# Altium project Sam4S Basic_5 .PrjPcb
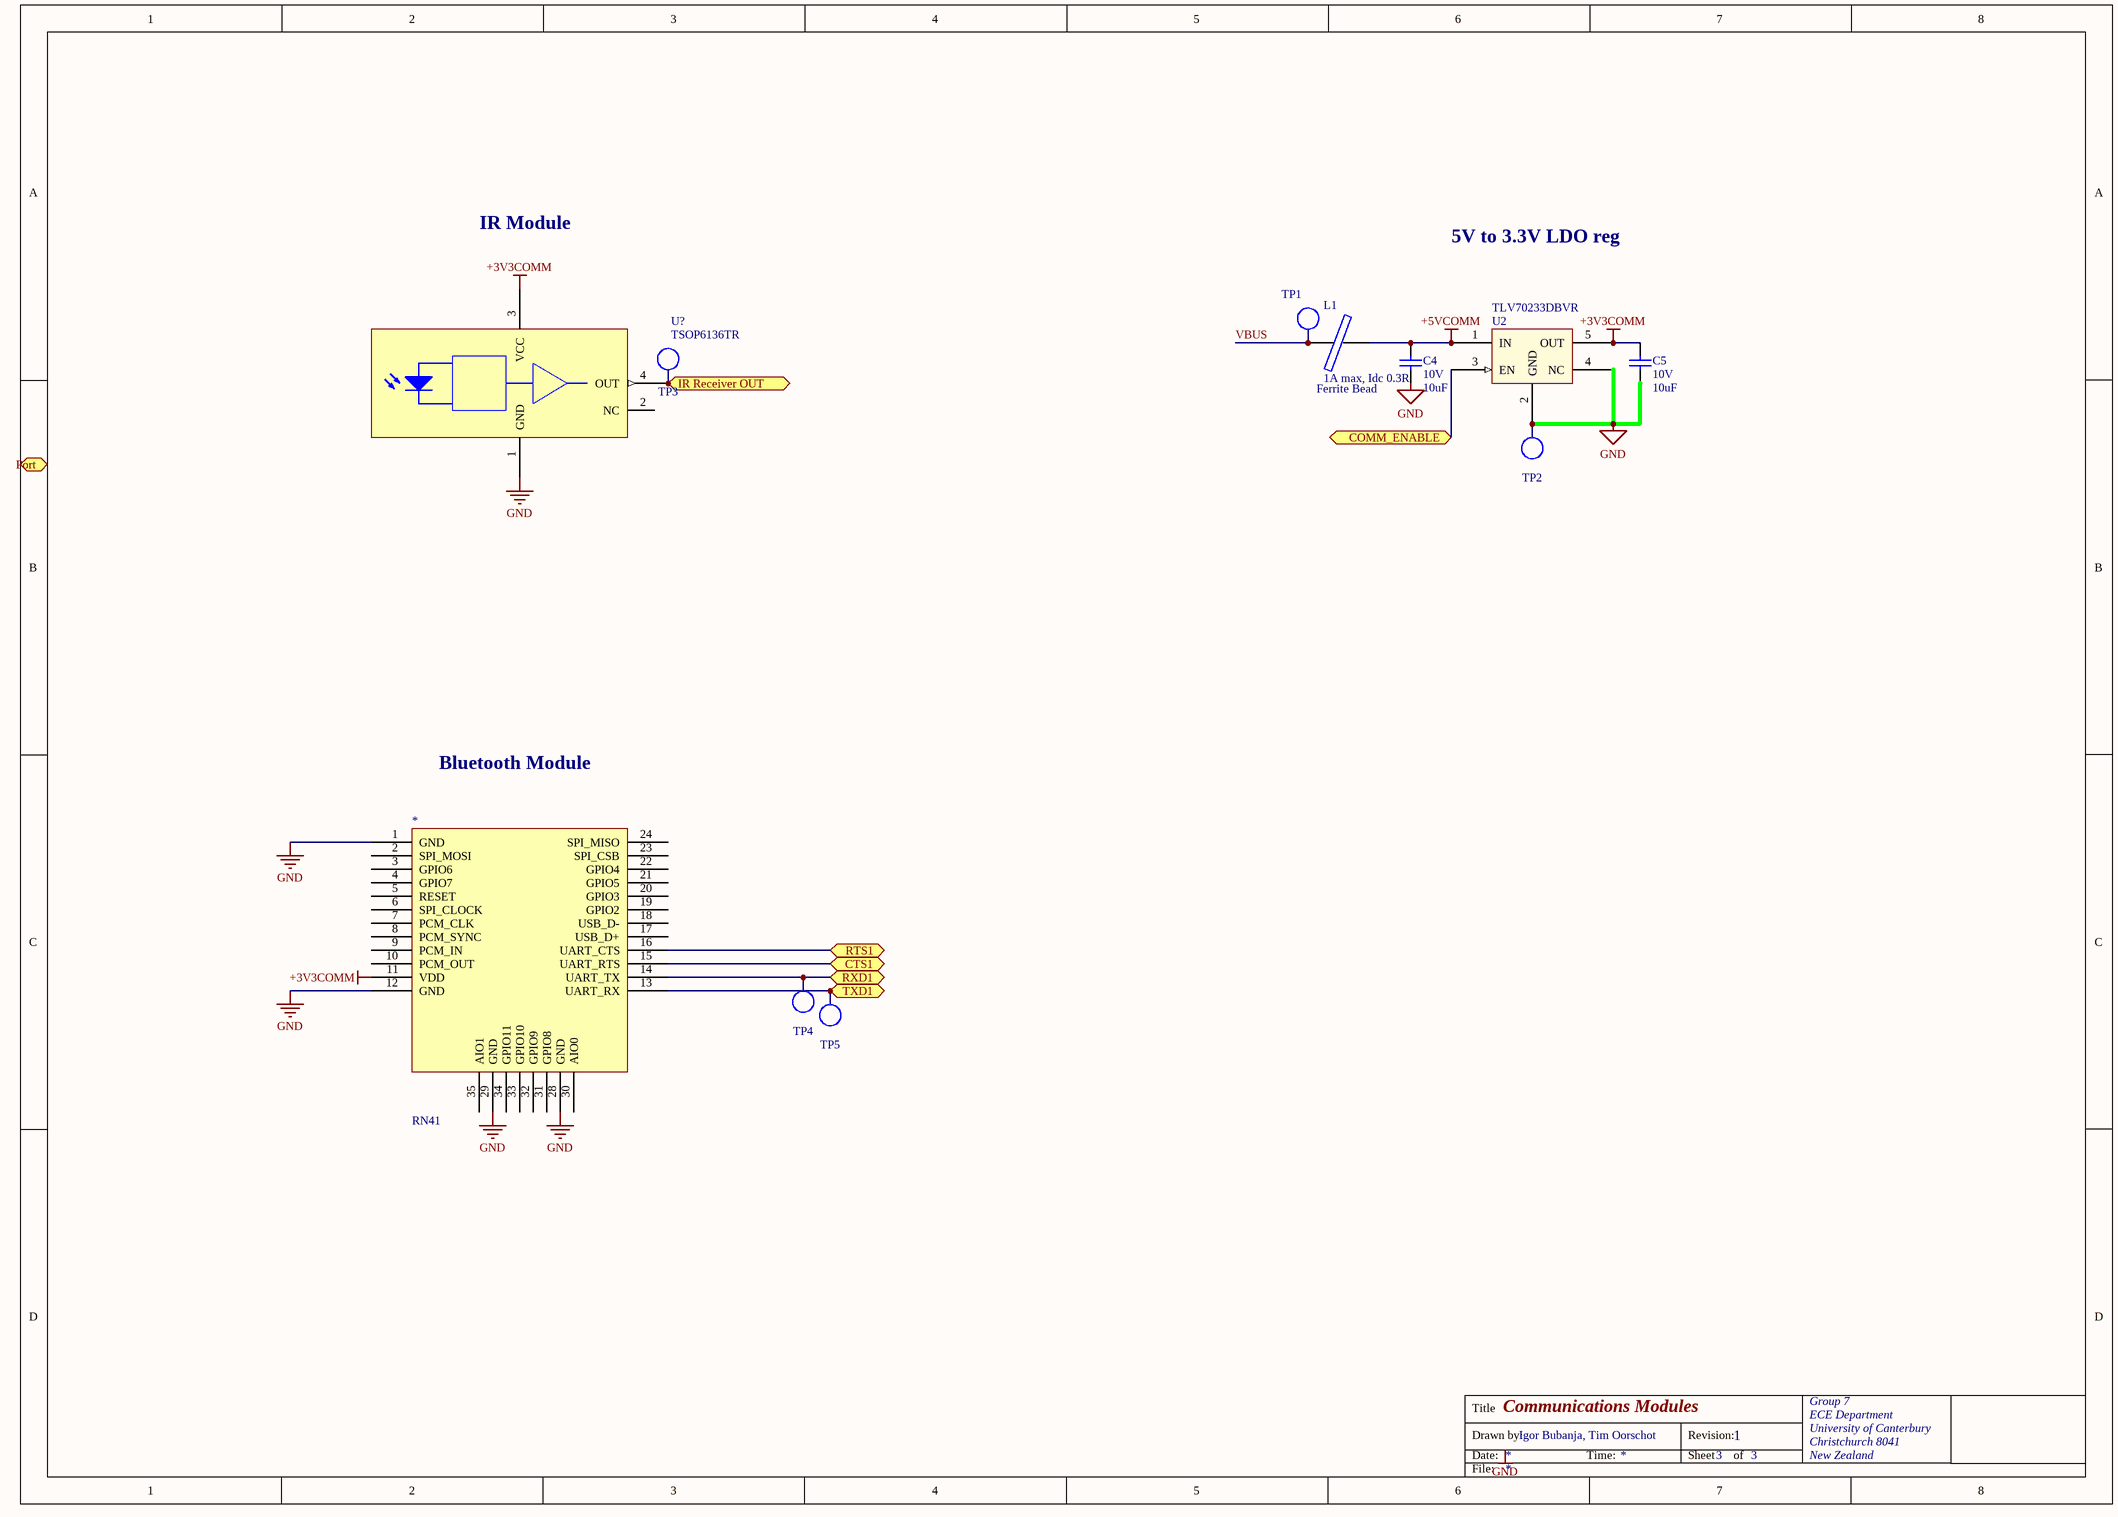
[diagram p0: Sheet1.SchDoc]
3 sheets, 79 parts. Net scope: flat (ports and power ports of the same name join across sheets).
Board file: Sam4S Basic Board 5.PcbDoc
Sheets:
  Sheet1.SchDoc
  Sam4S Basic Board 5.SchDoc
  Sam4S Power Distribution_5.SchDoc

## Sheet Sheet1.SchDoc: Communications Modules
size A3; DrawnBy: Igor Bubanja, Tim Oorschot; Organization: Group 7; Address1: ECE Department; Address2: University of Canterbury; Address3: Christchurch 8041; Address4: New Zealand; Revision: 1; SheetNumber: 3; SheetTotal: 3

### Parts
(Parts that share a designator on the sheet are numbered #1, #2 ... from top to bottom, then left to right.)
*  RN41
C4#1  Voltage - Rated: 10V  [CAPC1608L]  (hidden comment: 10uF)
C5#1  Voltage - Rated: 10V  [CAPC1608L]  (hidden comment: 10uF)
L1#1  Ferrite Bead  value 1A max, Idc 0.3R,  [INDC3216L]
TP1#1  V_Bus  [TP_0805]  (value not drawn)
TP2#1  Gnd  [TP_0805]  (value not drawn)
TP3#1  Gnd  [TP_0805]  (value not drawn)
TP4#1  Gnd  [TP_0805]  (value not drawn)
TP5#1  Gnd  [TP_0805]  (value not drawn)
U2#1  TLV70233DBVR  [SOT95P280X145-5N]
U?  TSOP6136TR  [TSOP61]

### Ports
COMM_ENABLE, CTS1, IR Receiver OUT, Port, RTS1, RXD1, TXD1

### Nets
+3V3COMM: *.11(VDD) C5#1.1 U2#1.5(OUT) U?.3(VCC)
+5VCOMM: C4#1.1 L1#1.2 U2#1.1(IN)
GND: *.1(GND) *.12(GND) *.28(GND) *.29(GND) C4#1.2 C5#1.2 TP2#1.1(TP) U2#1.2(GND) U2#1.4(NC) U?.1(GND)
VBUS: L1#1.1 TP1#1.1(TP)
Net*_13: *.13(UART_RX) TP5#1.1(TP) ; port TXD1
Net*_14: *.14(UART_TX) TP4#1.1(TP) ; port RXD1
Net*_15: *.15(UART_RTS) ; port CTS1
Net*_16: *.16(UART_CTS) ; port RTS1
NetTP3#1_1: TP3#1.1(TP) U?.4(OUT) ; port IR Receiver OUT
NetU1_38: U2#1.3(EN) ; port COMM_ENABLE

Not connected (* = marked no-connect by the designer): * 2(SPI_MOSI) 3(GPIO6) 4(GPIO7) 5(RESET) 6(SPI_CLOCK) 7(PCM_CLK) 8(PCM_SYNC) 9(PCM_IN) 10(PCM_OUT) 17(USB_D+) 18(USB_D-) 19(GPIO2) 20(GPIO3) 21(GPIO5) 22(GPIO4) 23(SPI_CSB) 24(SPI_MISO) 30(AIO0) 31(GPIO8) 32(GPIO9) 33(GPIO10) 34(GPIO11) 35(AIO1); U? 2(NC)

### Notes on the sheet
- IR Module
- 5V to 3.3V LDO reg
- Bluetooth Module
- Labels drawn without touching a wire or pin: GND
- Title
- Drawn by:
- Date:
- Time:
- Revision:
- Sheet
- of
- File:

### Library data of the parts
* = RN41: Bluetooth RN41
C4#1 C5#1 = CC_10uF_0603: CAP CER 10UF X5R +-20% 10V 0603; Supplier: ECE Dept; Storage Location: PCB Assembly WS; Value: 10uF
L1#1 = IN_Ferrite-Bead: Ferrite Bead, Rdc 0.3R, Z100MHZ 600R, Imax 1A, SMD 1206; Manufacturer: FAIR-RITE; Manufacturer PN: 2512066017Y1; DC Current Rating: 1; DC Resistance Max: 0.08; Ferrite Case Style: 1206 ^3216 Metric]; Frequency Range: 50MHz to 1; Impedance: 600; Impedance Tolerance: ± 25%; Supplier: ECE Dept; Storage Location: PCB Assembly WS; Ferrite Mounting: SMD; Supplier 1: Farnell; Supplier Part Number 1: 1612060; Manufacturer Part Number: 2512066017Y1
TP1#1 TP2#1 TP3#1 TP4#1 TP5#1 = TP_0805: Test Point 2.0X0.9X1.2mm SMD; Manufacturer: TE Connectivity AMP Connectors; Manufacturer Part Number: 1625854-2; Supplier 1: Digi-Key; Mounting Type: Surface Mount; Terminal: 0.079" x 0.049" x 0.057" (2.00mm x 1.25mm x 1.45mm); Type: PC Test Point; Supplier Part Number 1: A106144CT-ND
U2#1 = SV_TLV70233DBVR: IC REG LDO 3.3V 0.3A SOT23-5; Manufacturer: Texas Instruments; Current - Output: 300mA; Supplier 1: Digi-Key; Operating Temperature: -40°C ~ 125°C; Package / Case: SC-74A, SOT-753; Pricing: 1=0.77, 10=0.647, 25=0.5672, 100=0.4853, 250=0.421, 500=0.35658, 750=0.30789, 1000=0.2749 (NZD); Supplier Part Number 1: 296-32415-1-ND; Manufacturer Part Number: TLV70233DBVR
U? = TSOP6136TR: Infrared Receiver 36KHz; Manufacturer: Vishay Semiconductor Opto Division; Supplier 1: Farnell; Supplier Part Number 1: 1779685; Manufacturers PN: TSOP6136TR; Manufacturer Part Number: TSOP6136TR; Supplier 2: Digi-Key; Supplier Part Number: TSOP6136TR-ND; Supplier Part Number 2: TSOP6136TR-ND

## Sheet Sam4S Basic Board 5.SchDoc: Sam 4S Basic Board 5
size A4; DrawnBy: Igor Bubanja, TIm Oorschot; Address1: ECE Department; Address2: University of Canterbury; Address3: Christchurch 8041; Address4: New Zealand; Revision: 3; SheetNumber: 1; SheetTotal: 3; PageSetup: Record=PageOptions|CenterHorizontal=True|CenterVertical=True|PrintScale=0.97|XCorrection=1.00|YCorrection=1.00|PrintKind=0|BorderSize=5000000|LeftOffset=0|BottomOffset=0|Orientation=2|PaperLength=1000|PaperWidth=1000|Scale=100|PaperSource=7|PrintQuality=-3|MediaType=1|DitherType=10|PrintScaleMode=1|PaperKind=A4 (210 x 297 mm)|PaperIndex=9
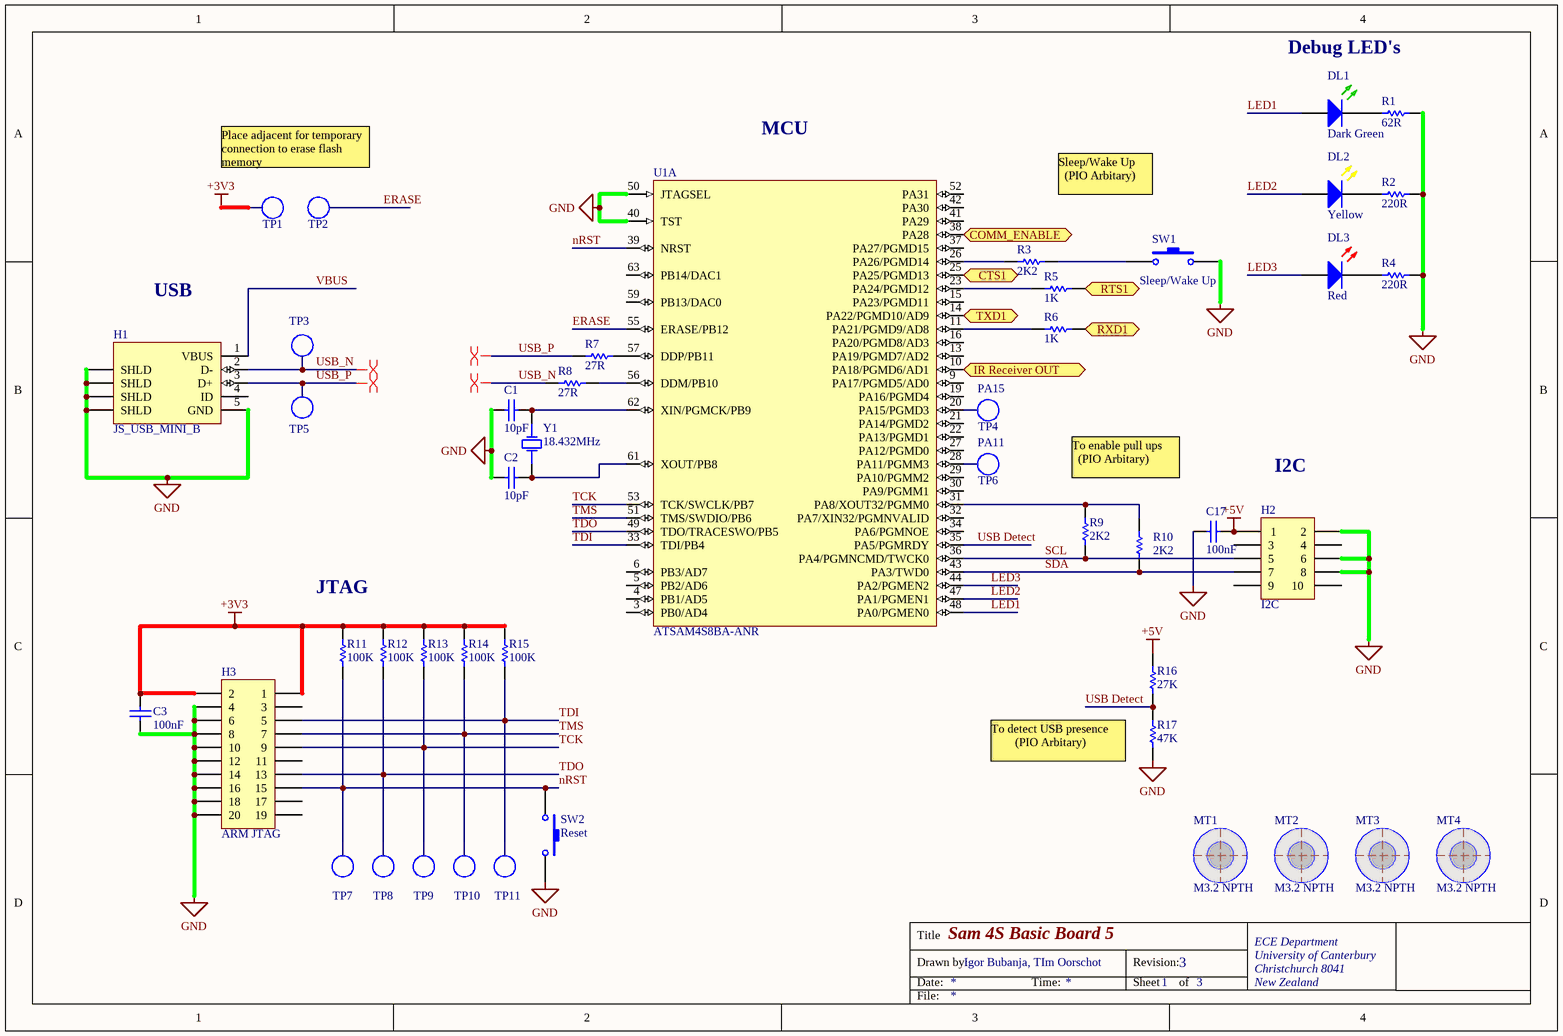
[diagram p1: Sam4S Basic Board 5.SchDoc]

### Parts
(Parts that share a designator on the sheet are numbered #1, #2 ... from top to bottom, then left to right.)
C1  10pF  [CAPC1608L]
C2  10pF  [CAPC1608L]
C3  100nF  [CAPC1608L]
C17  100nF  [CAPC1608L]
DL1  Dark Green  [WL-SMCW0603]
DL2  Yellow  [WL-SMCW0603]
DL3  Red  [WL-SMCW0603]
H1  JS_USB_MINI_B  [USB/SM0.8-6H5]
H2  I2C  [188275-10]
H3  ARM JTAG  [188275-20]
MT1  M3.2 NPTH  [MNT-HOLE_3.2mm_NPTH]  (no BOM)
MT2  M3.2 NPTH  [MNT-HOLE_3.2mm_NPTH]  (no BOM)
MT3  M3.2 NPTH  [MNT-HOLE_3.2mm_NPTH]  (no BOM)
MT4  M3.2 NPTH  [MNT-HOLE_3.2mm_NPTH]  (no BOM)
R1  62R  [RESC1608L]
R2  220R  [RESC1608L]
R3  2K2  [RESC1608L]
R4  220R  [RESC1608L]
R5  1K  [RESC1608L]
R6  1K  [RESC1608L]
R7  27R  [RESC1608L]
R8  27R  [RESC1608L]
R9  2K2  [RESC1608L]
R10  2K2  [RESC1608L]
R11  100K  [RESC1608L]
R12  100K  [RESC1608L]
R13  100K  [RESC1608L]
R14  100K  [RESC1608L]
R15  100K  [RESC1608L]
R16#1  27K  [RESC1608N]
R17  47K  [RESC1608N]
SW1  Sleep/Wake Up  [KSR211G]
SW2  Reset  [KSR211G]
TP1#2  3V3  [TP_0805]  (value not drawn)
TP2#2  Erase  [TP_0805]  (value not drawn)
TP3#2  USB_N  [TP_0805]  (value not drawn)
TP4#2  PA15  [TP_0805]
TP5#2  USB_P  [TP_0805]  (value not drawn)
TP6  PA11  [TP_0805]
TP7  nRST  [TP_0805]  (value not drawn)
TP8  TDO  [TP_0805]  (value not drawn)
TP9  TCK  [TP_0805]  (value not drawn)
TP10  TMS  [TP_0805]  (value not drawn)
TP11  TDI  [TP_0805]  (value not drawn)
U1  ATSAM4S8BA-ANR  [LQFP64_L]  (part A of 2)
Y1  18.432MHz  [6.0X3.5-4]

### Ports
COMM_ENABLE, CTS1, IR Receiver OUT, RTS1, RXD1, TXD1

### Nets
+3V3: C3.2 H3.1 H3.2 R11.2 R12.2 R13.2 R14.2 R15.2 TP1#2.1(TP)
+5V: C17.2 H2.1 R16#1.2
GND: C1.1 C2.1 C3.1 C17.1 H1.5(GND) H1.6(SHLD) H1.7(SHLD) H1.8(SHLD) H1.9(SHLD) H2.2 H2.6 H2.8 H3.4 H3.6 H3.8 H3.10 H3.12 H3.14 H3.16 H3.18 H3.20 R1.2 R2.2 R4.2 R17.1 SW1.2 SW2.2 U1.40(TST) U1.50(JTAGSEL)
ERASE: TP2#2.1(TP) U1.55(ERASE/PB12)
LED1: DL1.2(A) U1.48(PA0/PGMEN0)
LED2: DL2.2(A) U1.47(PA1/PGMEN1)
LED3: DL3.2(A) U1.44(PA2/PGMEN2)
nRST: H3.15 R11.1 SW2.1 TP7.1(TP) U1.39(NRST)
SCL: H2.5 R9.1 U1.36(PA4/PGMNCMD/TWCK0)
SDA: H2.7 R10.1 U1.43(PA3/TWD0)
TCK: H3.9 R13.1 TP9.1(TP) U1.53(TCK/SWCLK/PB7)
TDI: H3.5 R15.1 TP11.1(TP) U1.33(TDI/PB4)
TDO: H3.13 R12.1 TP8.1(TP) U1.49(TDO/TRACESWO/PB5)
TMS: H3.7 R14.1 TP10.1(TP) U1.51(TMS/SWDIO/PB6)
USB Detect: R16#1.1 R17.2 U1.35(PA5/PGMRDY)
USB_N: H1.2(D-) R8.1 TP3#2.1(TP)
USB_P: H1.3(D+) R7.1 TP5#2.1(TP)
VBUS: H1.1(VBUS)
Net*_13: U1.14(PA22/PGMD10/AD9) ; port TXD1
Net*_14: R6.2 ; port RXD1
Net*_15: U1.25(PA25/PGMD13) ; port CTS1
Net*_16: R5.2 ; port RTS1
NetC1_2: C1.2 U1.62(XIN/PGMCK/PB9) Y1.3(OSC2)
NetC2_2: C2.2 U1.61(XOUT/PB8) Y1.1(OSC1)
NetDL1_1: DL1.1(K) R1.1
NetDL2_1: DL2.1(K) R2.1
NetDL3_1: DL3.1(K) R4.1
NetR3_1: R3.1 U1.26(PA26/PGMD14)
NetR3_2: R3.2 SW1.1
NetR5_1: R5.1 U1.23(PA24/PGMD12)
NetR6_1: R6.1 U1.11(PA21/PGMD9/AD8)
NetR7_2: R7.2 U1.57(DDP/PB11)
NetR8_2: R8.2 U1.56(DDM/PB10)
NetR9_2: R9.2 R10.2 U1.31(PA8/XOUT32/PGMM0)
NetTP3#1_1: U1.10(PA18/PGMD6/AD1) ; port IR Receiver OUT
NetTP4#2_1: TP4#2.1(TP) U1.20(PA15/PGMD3)
NetTP6_1: TP6.1(TP) U1.28(PA11/PGMM3)
NetU1_38: U1.38(PA28) ; port COMM_ENABLE

Not connected (* = marked no-connect by the designer): H1 4(ID); H2 3 4 9 10; H3 3 11 17 19; U1 3(PB0/AD4) 4(PB1/AD5) 5(PB2/AD6) 6(PB3/AD7) 9(PA17/PGMD5/AD0) 13(PA19/PGMD7/AD2) 15(PA23/PGMD11) 16(PA20/PGMD8/AD3) 19(PA16/PGMD4) 21(PA14/PGMD2) 22(PA13/PGMD1) 27(PA12/PGMD0) 29(PA10/PGMM2) 30(PA9/PGMM1) 32(PA7/XIN32/PGMNVALID) 34(PA6/PGMNOE) 37(PA27/PGMD15) 41(PA29) 42(PA30) 52(PA31) 59(PB13/DAC0) 63(PB14/DAC1)

### Layout directives
differential pair: USB_N, USB_P

### Notes on the sheet
- Debug LED's
- Place adjacent for temporary
  connection to erase flash
  memory
- MCU
- Sleep/Wake Up
  (PIO Arbitary)
- USB
- To enable pull ups
  (PIO Arbitary)
- I2C
- JTAG
- To detect USB presence
  (PIO Arbitary)
- Title
- Drawn by:
- Date:
- Time:
- Revision:
- Sheet
- of
- File:

### Library data of the parts
C1 C2 = CC_10pF_0603: CAP CER 10pF COG/NPO 50V 0603; PackageReference: 0603; Code_IPC: 1005 [0402]; Verify: *; Supplier: ECE Dept; Storage Location: PCB Assembly WS; Value: 10pF
C3 C17 = CC_100nF_0603: CAP CER 100nF X7R +-10% 50V 0603; PackageReference: 0603; Code_IPC: 1608 [0603]; Verify: *; Supplier: ECE Dept; Storage Location: PCB Assembly WS; Value: 100nF
DL1 = DL_150060GS75000: LED Dk Green 430mcd 0603 SMD; Manufacturer: WURTH ELEKTRONIK; Forward Current If: 30; Wavelength Typ: 520; Forward Voltage: 3.2; Lens Shape: Rectangular; Luminous Intensity: 430; Viewing Angle: 140°; LED Mounting: SMD; Supplier 1: Farnell; Supplier Part Number 1: 2322070; Manufacturer Part Number: 150060GS75000; Storage Location: PCB Assembly WS; Supplier: ECE Dept; LED Colour: Dark Green
DL2 = DL_150060YS75000: LED Yellow 120mcd 0603 SMD; Manufacturer: WURTH ELEKTRONIK; Forward Current If: 30; Forward Voltage: 2; Wavelength Typ: 590; Lens Shape: Rectangular; Viewing Angle: 140°; Luminous Intensity: 120; LED Mounting: SMD; Supplier 1: Farnell; Supplier Part Number 1: 2322074; Manufacturer Part Number: 150060YS75000; Storage Location: PCB Assembly WS; Supplier: ECE Dept; LED Colour: Yellow
DL3 = DL_150060RS75000: LED Red 250mcd 0603 SMD; Manufacturer: WURTH ELEKTRONIK; Forward Current If: 30; Forward Voltage: 2; Lens Shape: Rectangular; Luminous Intensity: 250; Wavelength Typ: 625; Viewing Angle: 140°; LED Mounting: SMD; Supplier 1: Farnell; Supplier Part Number 1: 2322071; Manufacturer Part Number: 150060RS75000; Storage Location: PCB Assembly WS; Supplier: ECE Dept; LED Colour: Red
H1 = JS_USB_MINI_B_SMT: USB 2.0, Right Angle, SMT, B Type, Receptacle, 5 Position,; Manufacturer: FCI; Manufacturer PN: 10033526-N3212MLF; Supplier 1: Farnell; Supplier Part Number 1: 1824416; Storage Location: PCB Assembly WS; Supplier: ECE Dept
H2 = JB_HDR_IDC_5X2_VERT: IDC Header, 1,27mm, 10-Pin, Vert, SMT; Manufacturer: TE Connectivity; Manufacturer Part Number: 1-188275-0; Current Rating: 1.5 A; Mounting Angle: Vertical; Number of Positions / Contacts: 10; Pitch: 1.27 mm; Supplier: ECE Dept; Mounting Style: SMD/SMT; Storage Location: PCB Assembly WS; Supplier 1: Digi-Key; Supplier Part Number 1: A99476TR-ND
H3 = JB_HDR_IDC_10X2_VERT: IDC Header, 1,27mm, 20-Pin, Vert, SMT; Manufacturer: TE Connectivity; Manufacturer Part Number: 2-188275-0; Mounting Angle: Vertical; Number of Positions / Contacts: 20; Pitch: 1.27 mm; Mounting Style: SMD/SMT; Supplier: ECE Dept; Storage Location: PCB Assembly WS; Supplier 1: Digi-Key; Supplier Part Number 1: A99481CT-ND
MT1-MT4 = MC_M3.2_HOLE: Fixing M3.2 Mount Hole NPTH; Manufacturer: Hi-Q; Manufacturer PN: 3BV series M3 Clearance; price: 0; Supplier: ECE Dept; value: M3.2 NPTH
R1 = RS_62R: RES 62 OHM 1/10W 5% 0603 SMD; Storage Location: PCB Assembly WS; Supplier: ECE Dept; Value: 62R
R2 R4 = RS_220R: RES 220 OHM 1/10W 5% 0603 SMD; Storage Location: PCB Assembly WS; Supplier: ECE Dept; Value: 220R
R3 R9 R10 = RS_2K2: RES 2.2K OHM 1/10W 5% 0603 SMD; Storage Location: PCB Assembly WS; Supplier: ECE Dept; Value: 2K2
R5 R6 = RS_1K: RES 1.0K OHM 1/10W 5% 0603 SMD; Storage Location: PCB Assembly WS; Supplier: ECE Dept; Value: 1K
R7 R8 = RS_27R: RES 27 OHM 1/10W 5% 0603 SMD; Storage Location: PCB Assembly WS; Supplier: ECE Dept; Value: 27R
R11-R15 = RS_100K: RES 100K OHM 1/10W 5% 0603 SMD; Storage Location: PCB Assembly WS; Supplier: ECE Dept; Value: 100K
R16#1 = RS_27K: RES 27K OHM 1/10W 5% 0603 SMD; Storage Location: PCB Assembly WS; Supplier: ECE Dept; Value: 27K
R17 = RS_47K: RES 47.0K OHM 1/10W 5% 0603 SMD; Storage Location: PCB Assembly WS; Supplier: ECE Dept; Value: 47K
SW1 SW2 = WS_KSR211G LFS: SWITCH TACTILE SPST-NO SMD; Manufacturer: C & K COMPONENTS; Contact Current Max: 50; Contact Resistance: 100; Contact Voltage DC Nom: 32; Operating Force: 1.8; Contact Configuration: SPST-NO; Pricing: 1=0.538, 50=0.477, 100=0.416, 2500=0.219 (NZD); Supplier 1: Farnell; Supplier Part Number 1: 1437634; Storage Location: PCB Assembly WS; Supplier: ECE Dept; Manufacturer Part Number: KSR211G LFS
TP1#2 TP2#2 TP3#2 TP4#2 TP5#2 TP6-TP11 = TP_0805: as TP1#1 on sheet Sheet1; Supplier 1: Digi-Key; Mounting Type: Surface Mount; Terminal: 0.079" x 0.049" x 0.057" (2.00mm x 1.25mm x 1.45mm); Type: PC Test Point; Supplier Part Number 1: A106144CT-ND
U1 = SE_ATSAM4S16BA-MU: IC MCU 32BIT 512KB FLASH 64LQFP; Manufacturer: Atmel; Connectivity: I²C, IrDA, Memory Card, SPI, SSC, UART/USART, USB; Core Processor: ARM® Cortex®-M4; Core Size: 32-Bit; Data Converters: A/D 11x12b, D/A 2x12b; Number of I/O: 47; Peripherals: Brown-out Detect/Reset, DMA, POR, PWM, WDT; Program Memory Size: 512KB (512K x 8); RAM Size: 128K x 8; Speed: 120MHz; Voltage - Supply (Vcc/Vdd): 1.62 V ~ 3.6 V; PackageVersion: revJ, Jul-2007; PackageReference: 64PS; PackageDescription: 64-Pin Quad Flat No-Lead (QFN) Sawn, 9 x 9 x 1.0 mm Body, 0.5 mm Pitch, Exposed Pad; Code_JEDEC: MO-220VMMD-3; ComponentLink1Description: Manufacturer URL; ComponentLink1URL: http://www.atmel.com/; ComponentLink2Description: SAM4S Series Datasheet; ComponentLink2URL: http://www.atmel.com/dyn/resources/prod_documents/11100.pdf; ComponentLink3Description: SAM4S Series Summary; ComponentLink3URL: http://www.atmel.com/dyn/resources/prod_documents/11100S.pdf; Supplier 1: Digi-Key; Package / Case: 64-LQFP; Packaging: Cut Tape (CT); Program Memory Type: FLASH; Supplier Part Number 1: ATSAM4S8BA-ANRCT-ND; Manufacturer Part Number: ATSAM4S8BA-ANR
Y1 = XT_CRYSTAL_18.432MHz_13pF: 18.432 MHZ 4PF  6.0X3.5mm SMD; Manufacturer: CTS-Frequency Controls; Manufacturer Part Number: 406C35B18M43200; ESR (Equivalent Series Resistance): 40 Ohm; Frequency Stability: ±50ppm; Frequency Tolerance: ±30ppm; Load Capacitance: 13pF; Supplier 1: Digi-Key; Height: 0.047" (1.20mm); Mounting Type: Surface Mount; Package / Case: 4-SMD, No Lead (DFN, LCC); Size / Dimension: 0.236" L x 0.138" W (6.00mm x 3.50mm); Supplier Part Number 1: CTX668CT-ND; Frequency: 18.432MHz

## Sheet Sam4S Power Distribution_5.SchDoc: Sam4S Power Distribution
size A4; DrawnBy: Igor Bubanja, Tim Oorschot; Address1: ECE Department; Address2: University of Canterbury; Address3: Christchurch 8041; Address4: New Zealand; Revision: 3; SheetNumber: 2; SheetTotal: 3; PageSetup: Record=PageOptions|CenterHorizontal=True|CenterVertical=True|PrintScale=0.97|XCorrection=1.00|YCorrection=1.00|PrintKind=0|BorderSize=5000000|LeftOffset=0|BottomOffset=0|Orientation=2|PaperLength=1000|PaperWidth=1000|Scale=100|PaperSource=7|PrintQuality=-3|MediaType=1|DitherType=10|PrintScaleMode=1|PaperKind=A4 (210 x 297 mm)|PaperIndex=9
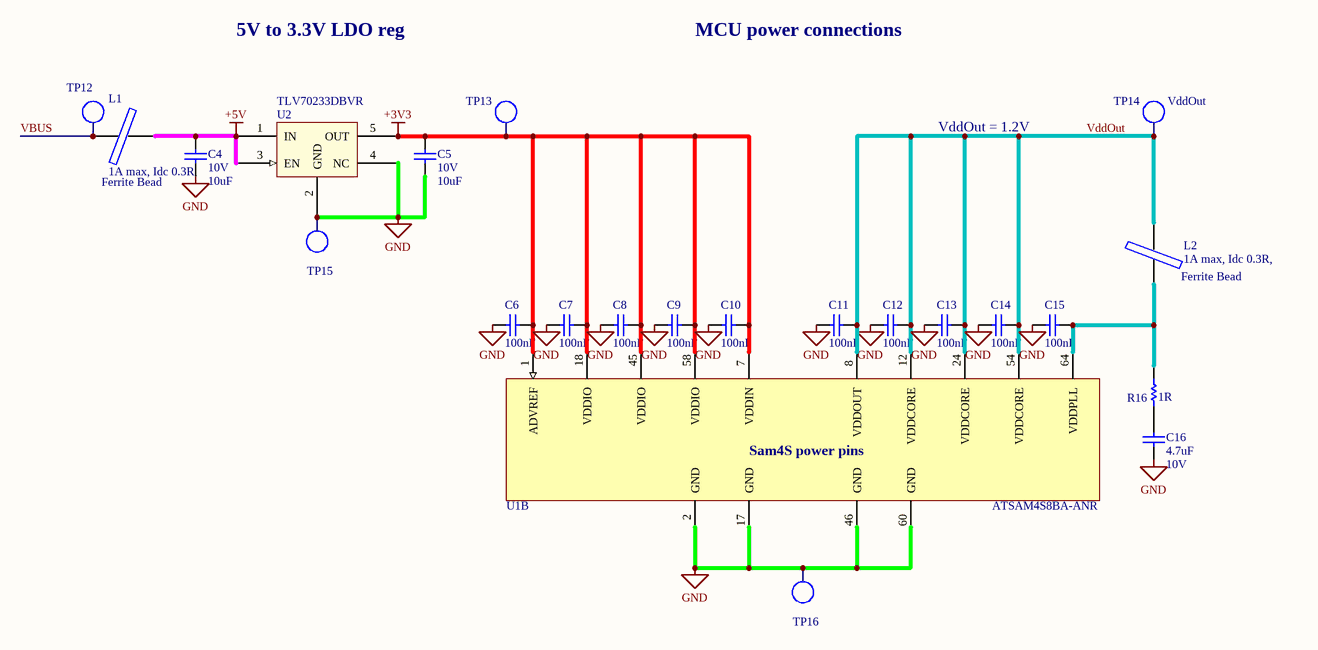
[diagram p2: Sam4S Power Distribution_5.SchDoc]

### Parts
(Parts that share a designator on the sheet are numbered #1, #2 ... from top to bottom, then left to right.)
C4#2  Voltage - Rated: 10V  [CAPC1608L]  (hidden comment: 10uF)
C5#2  Voltage - Rated: 10V  [CAPC1608L]  (hidden comment: 10uF)
C6  100nF  [CAPC1608L]
C7  100nF  [CAPC1608L]
C8  100nF  [CAPC1608L]
C9  100nF  [CAPC1608L]
C10  100nF  [CAPC1608L]
C11  100nF  [CAPC1608L]
C12  100nF  [CAPC1608L]
C13  100nF  [CAPC1608L]
C14  100nF  [CAPC1608L]
C15  100nF  [CAPC1608L]
C16  Max Voltage: 10V  [CAPC1608N]  (hidden comment: 4.7uF)
L1#2  Ferrite Bead  value 1A max, Idc 0.3R,  [INDC3216L]
L2  Ferrite Bead  value 1A max, Idc 0.3R,  [INDC3216L]
R16#2  1R  [RESC3216L]
TP12  V_Bus  [TP_0805]  (value not drawn)
TP13  3V3  [TP_0805]  (value not drawn)
TP14  VddOut  [TP_0805]
TP15  Gnd  [TP_0805]  (value not drawn)
TP16  Gnd  [TP_0805]  (value not drawn)
U1  ATSAM4S8BA-ANR  [LQFP64_L]  (part B of 2)
U2#2  TLV70233DBVR  [SOT95P280X145-5N]

### Nets
+3V3: C5#2.1 C6.2 C7.2 C8.2 C9.2 C10.2 TP13.1(TP) U1.1(ADVREF) U1.7(VDDIN) U1.18(VDDIO) U1.45(VDDIO) U1.58(VDDIO) U2#2.5(OUT)
+5V: C4#2.1 L1#2.2 U2#2.1(IN) U2#2.3(EN)
GND: C4#2.2 C5#2.2 C6.1 C7.1 C8.1 C9.1 C10.1 C11.1 C12.1 C13.1 C14.1 C15.1 C16.1 TP15.1(TP) TP16.1(TP) U1.2(GND) U1.17(GND) U1.46(GND) U1.60(GND) U2#2.2(GND) U2#2.4(NC)
VBUS: L1#2.1 TP12.1(TP)
VddOut: C11.2 C12.2 C13.2 C14.2 L2.2 TP14.1(TP) U1.8(VDDOUT) U1.12(VDDCORE) U1.24(VDDCORE) U1.54(VDDCORE)
NetC15_2: C15.2 L2.1 R16#2.2 U1.64(VDDPLL)
NetC16_2: C16.2 R16#2.1

### Notes on the sheet
- 5V to 3.3V LDO reg
- MCU power connections
- VddOut = 1.2V
- (near U1) Sam4S power pins
- Title
- Drawn by:
- Date:
- Time:
- Revision:
- Sheet
- of
- File:

### Library data of the parts
C4#2 C5#2 = CC_10uF_0603: CAP CER 10UF X5R +-20% 10V 0603; Supplier: ECE Dept; Storage Location: PCB Assembly WS; Value: 10uF
C6-C15 = CC_100nF_0603: CAP CER 100nF X7R +-10% 50V 0603; PackageReference: 0603; Code_IPC: 1608 [0603]; Verify: *; Supplier: ECE Dept; Storage Location: PCB Assembly WS; Value: 100nF
C16 = CC_4.7uF_0603: CAP CER 4.7uF X5R +-20%  10V 0603; Note: Footprint corresponds to dimensions for bulk cassette packaging. This case size has tightened tolerances.; PackageReference: 0805; Code_IPC: 2012[0805]; Verify: *; Supplier: ECE Dept; Storage Location: PCB Assembly WS; Value: 4.7uF
L1#2 L2 = IN_Ferrite-Bead: as L1#1 on sheet Sheet1; Supplier: ECE Dept; Storage Location: PCB Assembly WS; Ferrite Mounting: SMD; Supplier 1: Farnell; Supplier Part Number 1: 1612060; Manufacturer Part Number: 2512066017Y1
R16#2 = RT_1R: RES 1R OHM 1/4W 5% 1206 SMD; Storage Location: PCB Assembly WS; Supplier: ECE Dept; Value: 1R
TP12-TP16 = TP_0805: as TP1#1 on sheet Sheet1; Supplier 1: Digi-Key; Mounting Type: Surface Mount; Terminal: 0.079" x 0.049" x 0.057" (2.00mm x 1.25mm x 1.45mm); Type: PC Test Point; Supplier Part Number 1: A106144CT-ND
U1 = SE_ATSAM4S16BA-MU: as U1 on sheet Sam4S Basic Board 5; PackageVersion: revJ, Jul-2007; PackageReference: 64PS; PackageDescription: 64-Pin Quad Flat No-Lead (QFN) Sawn, 9 x 9 x 1.0 mm Body, 0.5 mm Pitch, Exposed Pad; Code_JEDEC: MO-220VMMD-3; ComponentLink1Description: Manufacturer URL; ComponentLink1URL: http://www.atmel.com/; ComponentLink2Description: SAM4S Series Datasheet; ComponentLink2URL: http://www.atmel.com/dyn/resources/prod_documents/11100.pdf; ComponentLink3Description: SAM4S Series Summary; ComponentLink3URL: http://www.atmel.com/dyn/resources/prod_documents/11100S.pdf; Supplier 1: Digi-Key; Package / Case: 64-LQFP; Packaging: Cut Tape (CT); Program Memory Type: FLASH; Supplier Part Number 1: ATSAM4S8BA-ANRCT-ND; Manufacturer Part Number: ATSAM4S8BA-ANR
U2#2 = SV_TLV70233DBVR: as U2#1 on sheet Sheet1; Supplier 1: Digi-Key; Operating Temperature: -40°C ~ 125°C; Package / Case: SC-74A, SOT-753; Pricing: 1=0.77, 10=0.647, 25=0.5672, 100=0.4853, 250=0.421, 500=0.35658, 750=0.30789, 1000=0.2749 (NZD); Supplier Part Number 1: 296-32415-1-ND; Manufacturer Part Number: TLV70233DBVR

## Nets that join several sheets
+3V3: Sam4S Basic Board 5 (9 pins), Sam4S Power Distribution_5 (13 pins)
+5V: Sam4S Basic Board 5 (C17.2 H2.1 R16#1.2), Sam4S Power Distribution_5 (C4#2.1 L1#2.2 U2#2.1 U2#2.3)
GND: Sheet1 (10 pins), Sam4S Basic Board 5 (29 pins), Sam4S Power Distribution_5 (21 pins)
Net*_13: Sheet1 (*.13 TP5#1.1), Sam4S Basic Board 5 (U1.14)
Net*_14: Sheet1 (*.14 TP4#1.1), Sam4S Basic Board 5 (R6.2)
Net*_15: Sheet1 (*.15), Sam4S Basic Board 5 (U1.25)
Net*_16: Sheet1 (*.16), Sam4S Basic Board 5 (R5.2)
NetTP3#1_1: Sheet1 (TP3#1.1 U?.4), Sam4S Basic Board 5 (U1.10)
NetU1_38: Sheet1 (U2#1.3), Sam4S Basic Board 5 (U1.38)